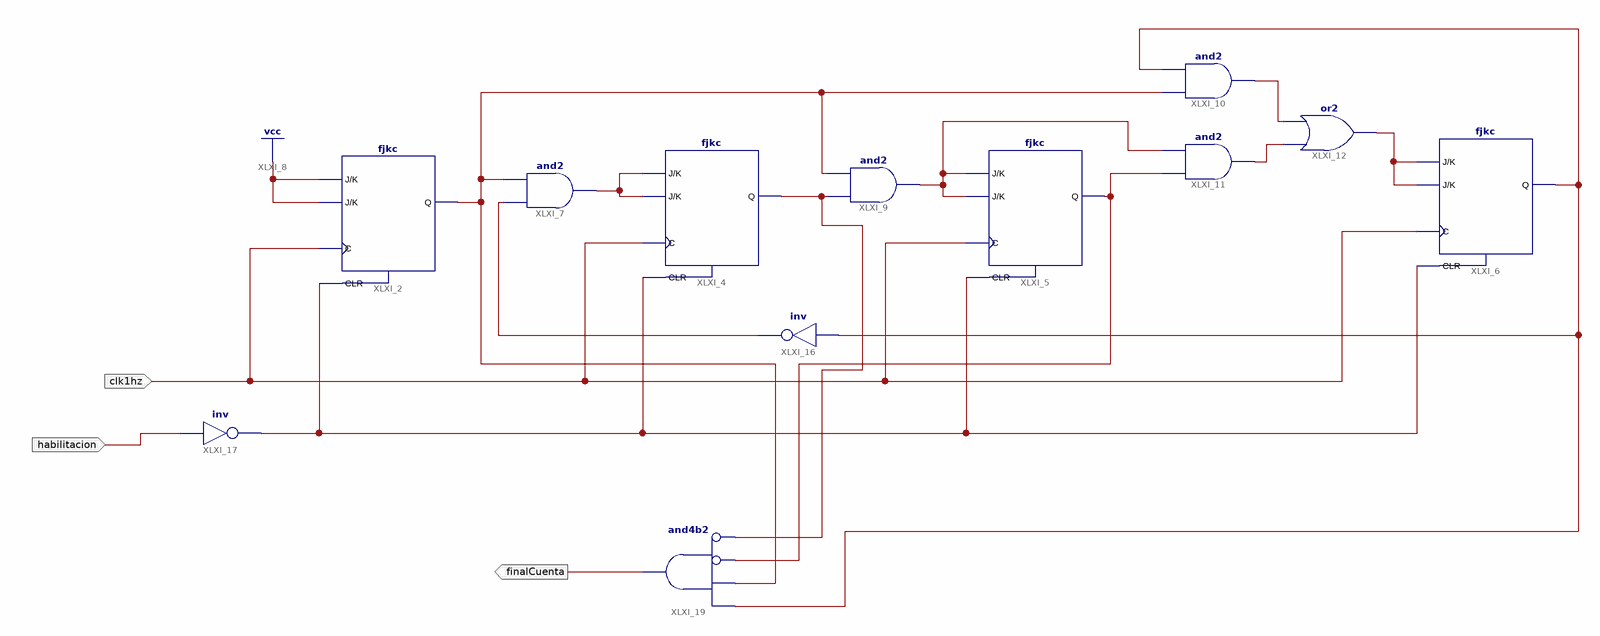
[diagram p0: schematic sheet 1]
// Xilinx ISE schematic contador10sin.sch (spartan3e) as structural Verilog: 12 symbols, 3 ports
module contador10sin (
  input  clk1hz,
  input  habilitacion,
  output finalCuenta
);

  wire XLXN_5, XLXN_7, XLXN_8, XLXN_9, XLXN_10, XLXN_15, XLXN_16, XLXN_17, XLXN_18, XLXN_20, XLXN_32;

  fjkc XLXI_2 (.C(clk1hz), .CLR(XLXN_32), .J(1'b1), .K(1'b1), .Q(XLXN_15));
  fjkc XLXI_4 (.C(clk1hz), .CLR(XLXN_32), .J(XLXN_5), .K(XLXN_5), .Q(XLXN_17));
  fjkc XLXI_5 (.C(clk1hz), .CLR(XLXN_32), .J(XLXN_7), .K(XLXN_7), .Q(XLXN_10));
  fjkc XLXI_6 (.C(clk1hz), .CLR(XLXN_32), .J(XLXN_18), .K(XLXN_18), .Q(XLXN_16));
  and XLXI_7 (XLXN_5, XLXN_20, XLXN_15);
  and XLXI_9 (XLXN_7, XLXN_17, XLXN_15);
  and XLXI_10 (XLXN_9, XLXN_15, XLXN_16);
  and XLXI_11 (XLXN_8, XLXN_10, XLXN_7);
  or XLXI_12 (XLXN_18, XLXN_8, XLXN_9);
  not XLXI_16 (XLXN_20, XLXN_16);
  not XLXI_17 (XLXN_32, habilitacion);
  and XLXI_19 (finalCuenta, ~XLXN_17, ~XLXN_10, XLXN_15, XLXN_16);  // and4b2
endmodule
